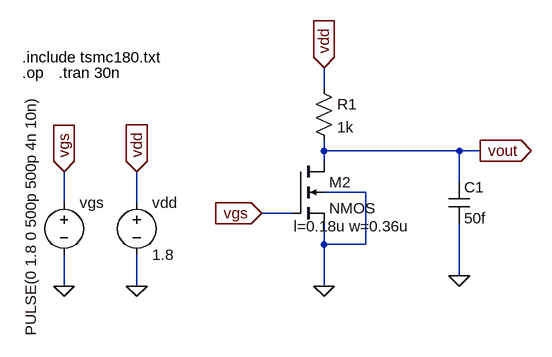
[diagram p0: schematic strong0weak1nmos.asc]
strong0weak1nmos.asc, the LTspice schematic file:
Version 4
SHEET 1 880 680
WIRE -272 48 -272 16
WIRE -272 144 -272 128
WIRE -64 144 -272 144
WIRE -32 144 -64 144
WIRE -272 160 -272 144
WIRE -64 192 -64 144
WIRE -208 208 -272 208
WIRE -672 224 -672 176
WIRE -560 224 -560 176
WIRE -320 240 -368 240
WIRE -272 288 -272 256
WIRE -208 288 -208 208
WIRE -208 288 -272 288
WIRE -64 336 -64 256
WIRE -672 352 -672 304
WIRE -560 352 -560 304
WIRE -272 352 -272 288
FLAG -272 352 0
FLAG -672 352 0
FLAG -672 176 vgs
IOPIN -672 176 In
FLAG -368 240 vgs
IOPIN -368 240 In
FLAG -560 352 0
FLAG -560 176 vdd
IOPIN -560 176 In
FLAG -272 16 vdd
IOPIN -272 16 In
FLAG -64 336 0
FLAG -32 144 vout
IOPIN -32 144 Out
SYMBOL nmos4 -320 160 R0
WINDOW 123 1 100 Left 2
SYMATTR Value2 l=0.18u w=0.36u
SYMATTR InstName M2
SYMBOL voltage -672 208 R0
WINDOW 123 0 0 Left 0
WINDOW 39 0 0 Left 0
WINDOW 3 -51 -150 VRight 2
SYMATTR InstName vgs
SYMATTR Value PULSE(0 1.8 0 500p 500p 4n 10n)
SYMBOL voltage -560 208 R0
WINDOW 123 0 0 Left 0
WINDOW 39 0 0 Left 0
SYMATTR InstName vdd
SYMATTR Value 1.8
SYMBOL res -288 32 R0
SYMATTR InstName R1
SYMATTR Value 1k
SYMBOL cap -80 192 R0
SYMATTR InstName C1
SYMATTR Value 50f
TEXT -736 24 Left 2 !.op
TEXT -736 0 Left 2 !.include tsmc180.txt
TEXT -680 24 Left 2 !.tran 30n

The netlist it stands for:
* strong0weak1nmos.asc
M2 vout vgs 0 0 NMOS l=0.18u w=0.36u
vgs vgs 0 PULSE(0 1.8 0 500p 500p 4n 10n)
vdd vdd 0 1.8
R1 vdd vout 1k
C1 vout 0 50f
.model NMOS NMOS
.model PMOS PMOS
.lib standard.mos
.op
.include tsmc180.txt
.tran 30n
.backanno
.end